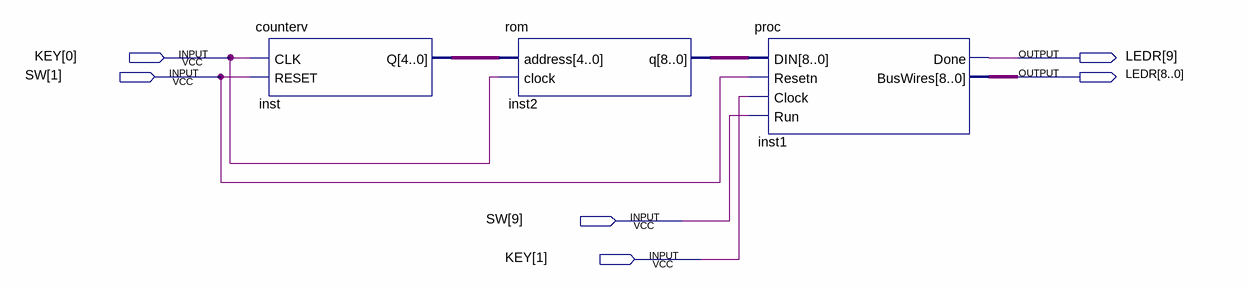
[diagram p0: schematic sheet]
// Quartus schematic part3.bdf as structural Verilog: 3 symbols, 6 pins
module part3 (
  input  [1:0] KEY,
  input  [9:1] SW,
  output [9:0] LEDR
);

  wire [4:0] inst_q;
  wire [8:0] inst2_q;

  counterv inst (.CLK(KEY[0]), .RESET(SW[1]), .Q(inst_q));
  rom inst2 (.address(inst_q), .clock(KEY[0]), .q(inst2_q));
  proc inst1 (.DIN(inst2_q), .Resetn(SW[1]), .Clock(KEY[1]), .Run(SW[9]), .Done(LEDR[9]), .BusWires(LEDR[8:0]));
endmodule
